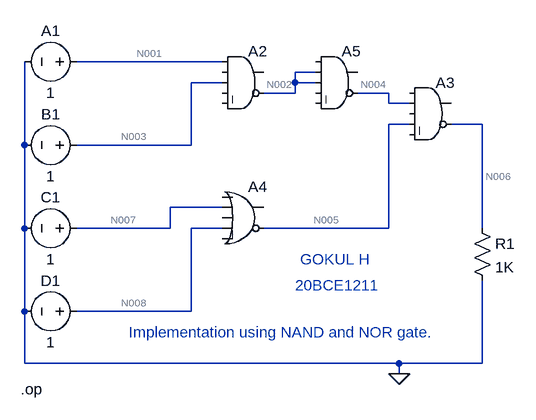
[diagram p0: schematic FAT2.asc]
FAT2.asc, the LTspice schematic file:
Version 4
SHEET 1 1160 680
WIRE -48 -80 -272 -80
WIRE 96 -64 64 -64
WIRE -48 -48 -96 -48
WIRE 64 -48 64 -64
WIRE 96 -48 64 -48
WIRE 64 -32 64 -48
WIRE 64 -32 16 -32
WIRE 208 -32 160 -32
WIRE 208 -16 208 -32
WIRE 240 -16 208 -16
WIRE 240 16 208 16
WIRE 352 16 304 16
WIRE -352 48 -352 -80
WIRE -96 48 -96 -48
WIRE -96 48 -272 48
WIRE -48 144 -128 144
WIRE -352 176 -352 48
WIRE -128 176 -128 144
WIRE -128 176 -272 176
WIRE -48 176 -96 176
WIRE 208 176 208 16
WIRE 208 176 16 176
WIRE 352 176 352 16
WIRE -352 304 -352 176
WIRE -96 304 -96 176
WIRE -96 304 -272 304
WIRE -352 384 -352 304
WIRE 224 384 -352 384
WIRE 352 384 352 256
WIRE 352 384 224 384
WIRE 224 400 224 384
FLAG 224 400 0
SYMBOL voltage -256 -80 R90
WINDOW 0 -32 56 VBottom 2
WINDOW 3 32 56 VTop 2
SYMATTR InstName A1
SYMATTR Value 1
SYMBOL voltage -256 48 R90
WINDOW 0 -32 56 VBottom 2
WINDOW 3 32 56 VTop 2
SYMATTR InstName B1
SYMATTR Value 1
SYMBOL voltage -256 176 R90
WINDOW 0 -32 56 VBottom 2
WINDOW 3 32 56 VTop 2
SYMATTR InstName C1
SYMATTR Value 1
SYMBOL voltage -256 304 R90
WINDOW 0 -32 56 VBottom 2
WINDOW 3 32 56 VTop 2
SYMATTR InstName D1
SYMATTR Value 1
SYMBOL Digital\\and -16 -112 R0
SYMATTR InstName A2
SYMBOL Digital\\and 272 -64 R0
SYMATTR InstName A3
SYMBOL Digital\\or -16 96 R0
SYMATTR InstName A4
SYMBOL res 336 160 R0
SYMATTR InstName R1
SYMATTR Value 1K
SYMBOL Digital\\and 128 -112 R0
SYMATTR InstName A5
TEXT 72 224 Left 2 ;GOKUL H
TEXT 64 264 Left 2 ;20BCE1211
TEXT -192 336 Left 2 ;Implementation using NAND and NOR gate.
TEXT -358 424 Left 2 !.op

The netlist it stands for:
* FAT2.asc
V§A1 N001 0 1
V§B1 N003 0 1
V§C1 N007 0 1
V§D1 N008 0 1
A2 N001 0 N003 0 0 N002 0 0 AND
A3 0 N004 0 N005 0 N006 0 0 AND
A4 0 N007 0 N008 0 N005 0 0 OR
R1 N006 0 1K
A5 0 N002 N002 0 0 N004 0 0 AND
* GOKUL H
* 20BCE1211
* Implementation using NAND and NOR gate.
.op
.backanno
.end

* Results of the author's LTspice run, read from the files saved beside the schematic
* Operating Point:
*   V(n001) = 1 V
*   V(n003) = 1 V
*   V(n007) = 1 V
*   V(n008) = 1 V
*   V(n002) = 0 V
*   V(n004) = 1 V
*   V(n005) = 0 V
*   V(n006) = 999 mV
*   I(R1) = 999 µA
*   I(D1) = 0 A
*   I(C1) = 0 A
*   I(B1) = 0 A
*   I(A1) = 0 A
*   I8(A4) = 0 A
*   I6(A4) = 0 A
*   I8(A5) = 0 A
*   I6(A5) = 0 A
*   I8(A3) = 999 µA
*   I6(A3) = -999 µA
*   I8(A2) = 0 A
*   I6(A2) = 0 A